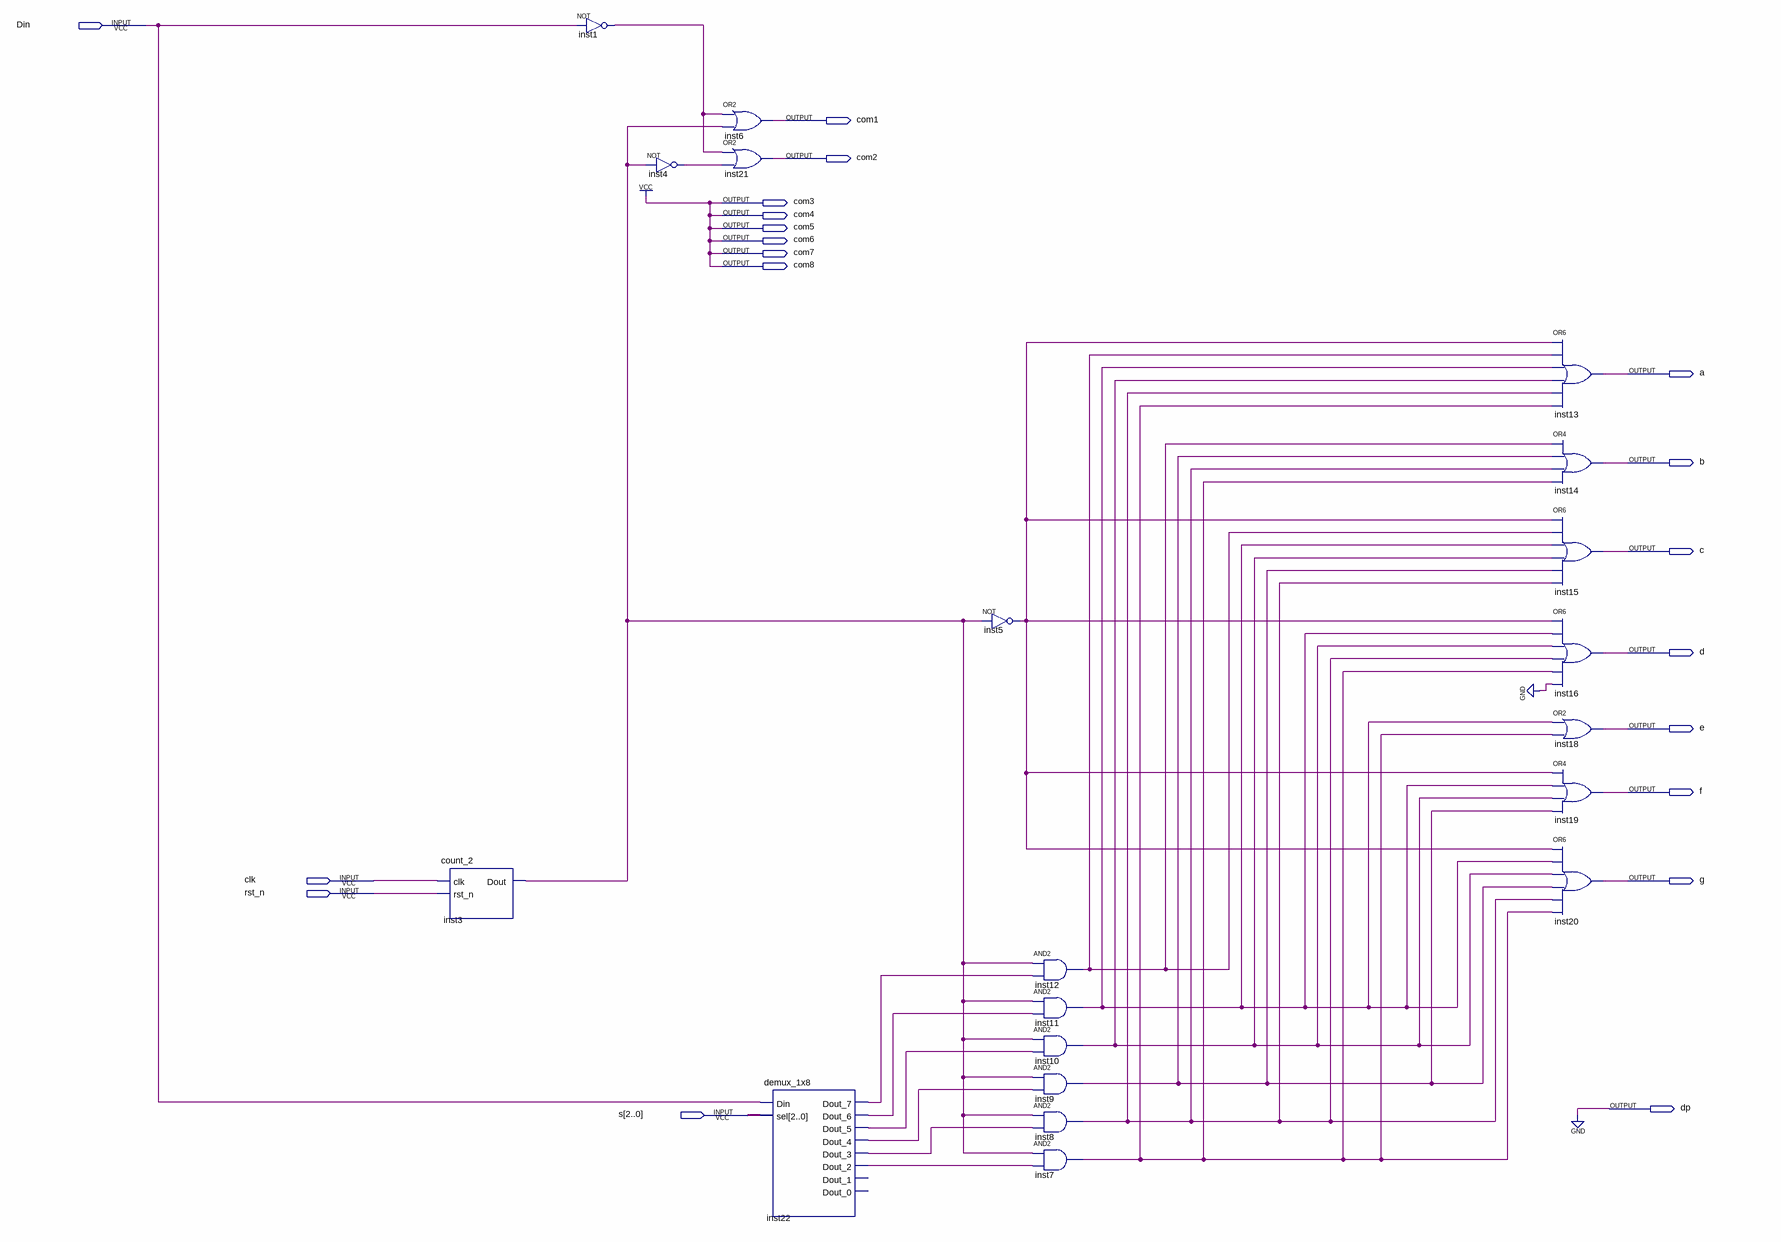
[diagram p0: schematic sheet]
// Quartus schematic render_s234567.bdf as structural Verilog: 20 symbols, 20 pins
module render_s234567 (
  input  Din,
  input  clk,
  input  rst_n,
  input  [2:0] s,
  output com1,
  output com2,
  output com3,
  output com4,
  output com5,
  output com6,
  output com7,
  output com8,
  output a,
  output b,
  output c,
  output d,
  output e,
  output f,
  output g,
  output dp
);

  wire inst1_out, inst3_dout, inst4_out, inst5_out, inst7_out, inst8_out, inst9_out, inst10_out, inst11_out,
       inst12_out, inst22_dout_2, inst22_dout_3, inst22_dout_4, inst22_dout_5, inst22_dout_6, inst22_dout_7;

  count_2 inst3 (.clk(clk), .rst_n(rst_n), .Dout(inst3_dout));
  not inst1 (inst1_out, Din);
  not inst4 (inst4_out, inst3_dout);
  or inst6 (com1, inst1_out, inst3_dout);
  or inst21 (com2, inst1_out, inst4_out);
  demux_1x8 inst22 (
    .Din(Din), .sel(s), .Dout_7(inst22_dout_7), .Dout_6(inst22_dout_6), .Dout_5(inst22_dout_5),
    .Dout_4(inst22_dout_4), .Dout_3(inst22_dout_3), .Dout_2(inst22_dout_2));  // open: Dout_1, Dout_0
  not inst5 (inst5_out, inst3_dout);
  and inst12 (inst12_out, inst3_dout, inst22_dout_7);
  and inst11 (inst11_out, inst3_dout, inst22_dout_6);
  and inst10 (inst10_out, inst3_dout, inst22_dout_5);
  and inst9 (inst9_out, inst3_dout, inst22_dout_4);
  and inst8 (inst8_out, inst3_dout, inst22_dout_3);
  and inst7 (inst7_out, inst3_dout, inst22_dout_2);
  or inst13 (a, inst5_out, inst12_out, inst11_out, inst10_out, inst8_out, inst7_out);
  or inst14 (b, inst12_out, inst9_out, inst8_out, inst7_out);
  or inst15 (c, inst5_out, inst12_out, inst11_out, inst10_out, inst9_out, inst8_out);
  or inst16 (d, inst5_out, inst11_out, inst10_out, inst8_out, inst7_out, 1'b0);
  or inst18 (e, inst11_out, inst7_out);
  or inst19 (f, inst5_out, inst11_out, inst10_out, inst9_out);
  or inst20 (g, inst5_out, inst11_out, inst10_out, inst9_out, inst8_out, inst7_out);

  assign com3 = 1'b1;
  assign com4 = 1'b1;
  assign com5 = 1'b1;
  assign com6 = 1'b1;
  assign com7 = 1'b1;
  assign com8 = 1'b1;
  assign dp = 1'b0;
endmodule
